# Altium schematic sheet MCU.SchDoc
size 420 x 297 mm; Address1: Address1; Address2: Address2; Address3: Address3; Address4: Address4; SheetNumber: 2; SheetTotal: 2; Scale: 1:1; Обозначение документа: ВРГД.468332.001 Э3
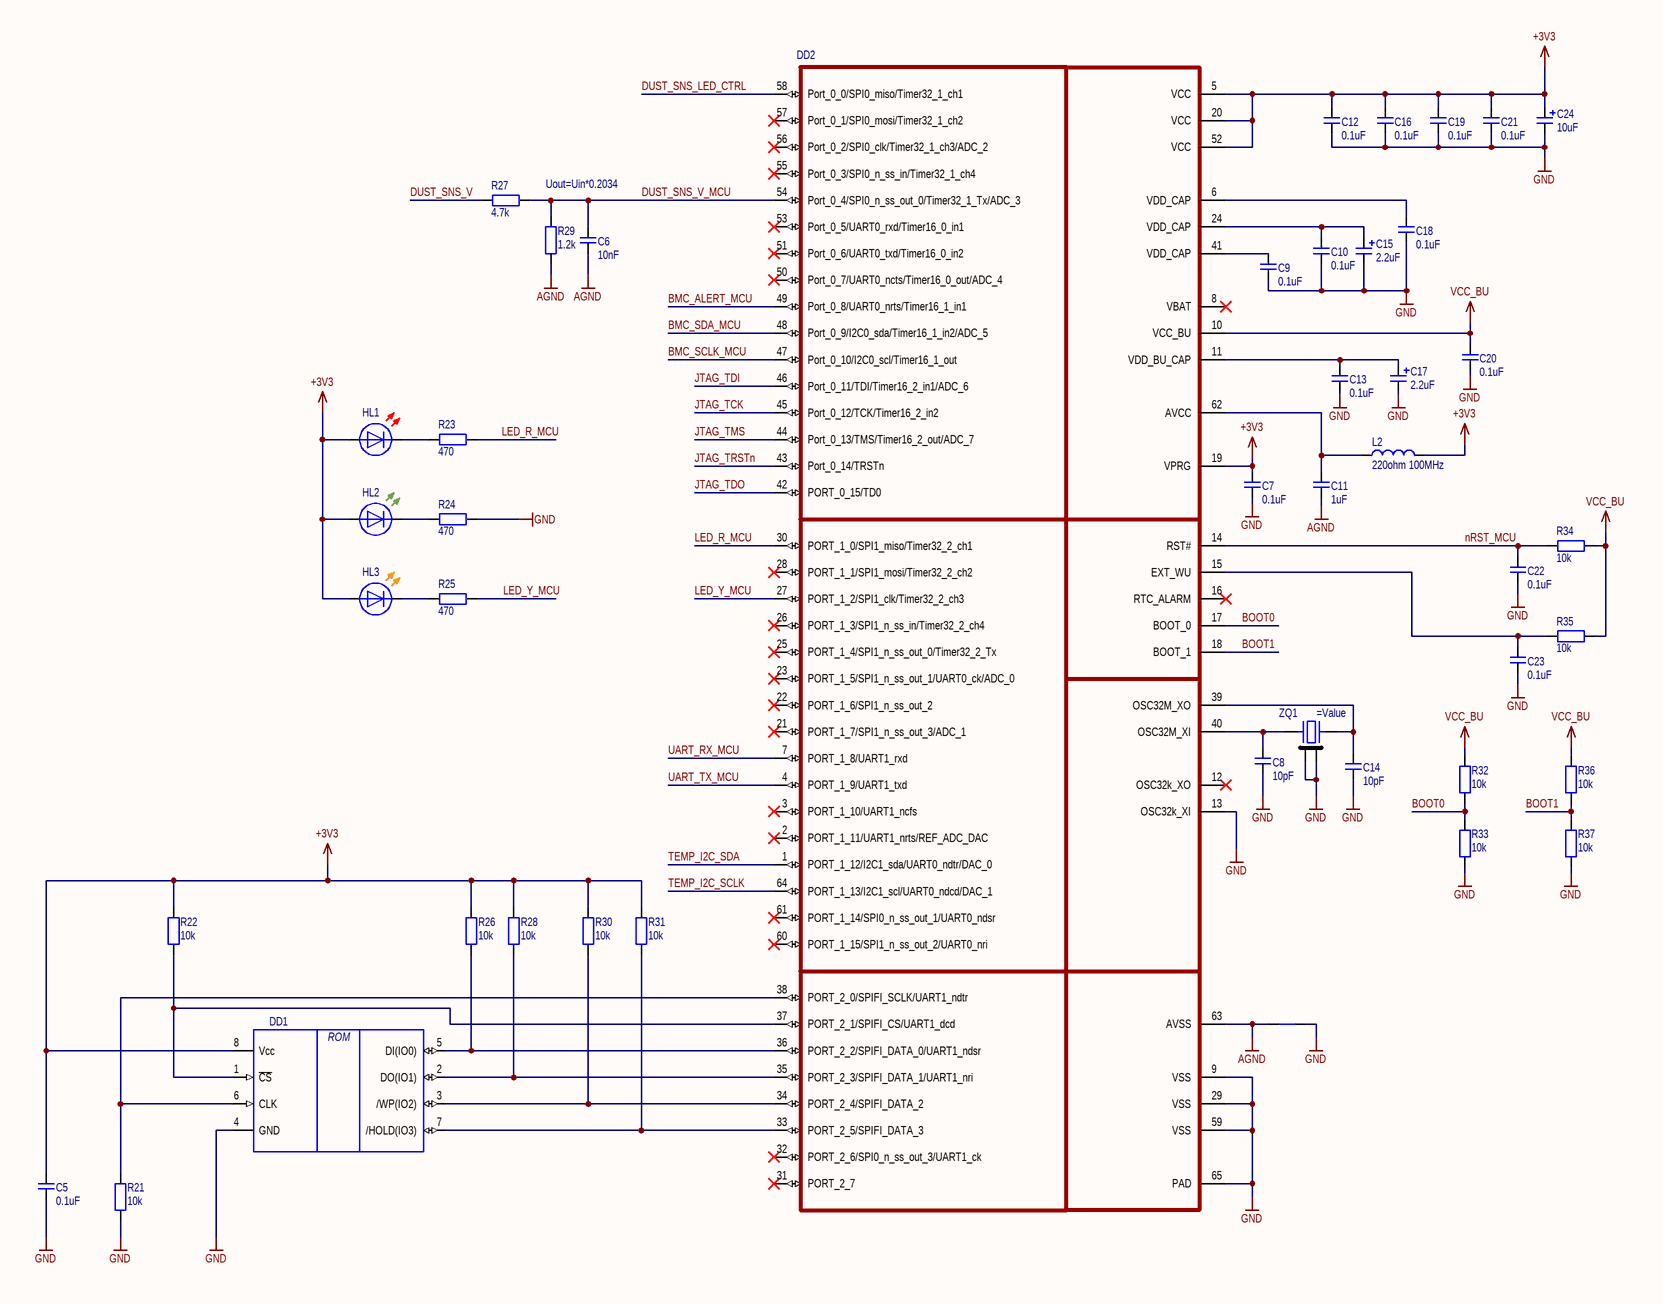
[diagram p0: MCU.SchDoc]

## Parts
C5  0.1uF  [CAP 0603_1608]
C6  10nF  [CAP 0603_1608]
C7  0.1uF  [CAP 0603_1608]
C8  10pF  [CAP 0603_1608]
C9  0.1uF  [CAP 0603_1608]
C10  0.1uF  [CAP 0603_1608]
C11  1uF  [CAP 0805_2012]
C12  0.1uF  [CAP 0603_1608]
C13  0.1uF  [CAP 0603_1608]
C14  10pF  [CAP 0603_1608]
C15  2.2uF  [CAP ALSMD ELEC 4.3MM H5.4MM]
C16  0.1uF  [CAP 0603_1608]
C17  2.2uF  [CAP ALSMD ELEC 4.3MM H5.4MM]
C18  0.1uF  [CAP 0603_1608]
C19  0.1uF  [CAP 0603_1608]
C20  0.1uF  [CAP 0603_1608]
C21  0.1uF  [CAP 0603_1608]
C22  0.1uF  [CAP 0603_1608]
C23  0.1uF  [CAP 0603_1608]
C24  10uF  [CAP ALSMD ELEC 4.3MM H5.4MM]
DD1  W25Q16JVSNIQ  [WINBOND SOIC-8]  (value not drawn)
DD2  К1948ВК018 АДКБ.431290.418ТУ  [QFN40P800X800X76_HS-65M]  (value not drawn)
HL1  KP-1608SURC  [LED 0603_1608 RED]  (value not drawn)
HL2  KPH-1608MGC  [LED 0603_1608 GREEN]  (value not drawn)
HL3  KPH-1608SYC  [LED 0603_1608 YELLOW]  (value not drawn)
J1  (no value)  [NET_TIE_1MM]  (net tie, no BOM)
L2  220ohm 100MHz  [FER 0805_2012]
R21  10k  [RES 0603_1608]
R22  10k  [RES 0603_1608]
R23  470  [RES 0603_1608]
R24  470  [RES 0603_1608]
R25  470  [RES 0603_1608]
R26  10k  [RES 0603_1608]
R27  4.7k  [RES 0603_1608]
R28  10k  [RES 0603_1608]
R29  1.2k  [RES 0603_1608]
R30  10k  [RES 0603_1608]
R31  10k  [RES 0603_1608]
R32  10k  [RES 0603_1608]
R33  10k  [RES 0603_1608]
R34  10k  [RES 0603_1608]
R35  10k  [RES 0603_1608]
R36  10k  [RES 0603_1608]
R37  10k  [RES 0603_1608]
ZQ1  (no value)  [XTAL3225X07N]

## Nets
+3V3: C5.2 C7.2 C12.2 C16.2 C19.2 C21.2 C24.1(P) DD1.8(Vcc) DD2.5(VCC) DD2.19(VPRG) DD2.20(VCC) DD2.52(VCC) HL1.1(A) HL2.1(A) HL3.1(A) L2.2(N) R22.1 R26.2 R28.2 R30.2 R31.2
AGND: C6.1 C11.1 DD2.63(AVSS) J1.1(P) R29.1
GND: C5.1 C7.1 C8.1 C9.1 C10.1 C12.1 C13.1 C14.1 C15.2(N) C16.1 C17.2(N) C18.1 C19.1 C20.1 C21.1 C22.1 C23.1 C24.2(N) DD1.4(GND) DD2.9(VSS) DD2.13(OSC32k_XI) DD2.29(VSS) DD2.59(VSS) DD2.65(PAD) J1.2(N) R21.1 R24.2 R33.1 R37.1 ZQ1.2 ZQ1.4
VCC_BU: C20.2 DD2.10(VCC_BU) R32.2 R34.1 R35.1 R36.2
BMC_ALERT_MCU: DD2.49(Port_0_8/UART0_nrts/Timer16_1_in1)
BMC_SCLK_MCU: DD2.47(Port_0_10/I2C0_scl/Timer16_1_out)
BMC_SDA_MCU: DD2.48(Port_0_9/I2C0_sda/Timer16_1_in2/ADC_5)
BOOT0: DD2.17(BOOT_0) R32.1 R33.2
BOOT1: DD2.18(BOOT_1) R36.1 R37.2
DUST_SNS_LED_CTRL: DD2.58(Port_0_0/SPI0_miso/Timer32_1_ch1)
DUST_SNS_V: R27.1
DUST_SNS_V_MCU: C6.2 DD2.54(Port_0_4/SPI0_n_ss_out_0/Timer32_1_Tx/ADC_3) R27.2 R29.2
JTAG_TCK: DD2.45(Port_0_12/TCK/Timer16_2_in2)
JTAG_TDI: DD2.46(Port_0_11/TDI/Timer16_2_in1/ADC_6)
JTAG_TDO: DD2.42(PORT_0_15/TD0)
JTAG_TMS: DD2.44(Port_0_13/TMS/Timer16_2_out/ADC_7)
JTAG_TRSTn: DD2.43(Port_0_14/TRSTn)
LED_R_MCU: DD2.30(PORT_1_0/SPI1_miso/Timer32_2_ch1) R23.2
LED_Y_MCU: DD2.27(PORT_1_2/SPI1_clk/Timer32_2_ch3) R25.2
nRST_MCU: C22.2 DD2.14(RST#) R34.2
TEMP_I2C_SCLK: DD2.64(PORT_1_13/I2C1_scl/UART0_ndcd/DAC_1)
TEMP_I2C_SDA: DD2.1(PORT_1_12/I2C1_sda/UART0_ndtr/DAC_0)
UART_RX_MCU: DD2.7(PORT_1_8/UART1_rxd)
UART_TX_MCU: DD2.4(PORT_1_9/UART1_txd)
NetC8_2: C8.2 DD2.40(OSC32M_XI) ZQ1.1
NetC9_2: C9.2 DD2.41(VDD_CAP)
NetC10_2: C10.2 C15.1(P) DD2.24(VDD_CAP)
NetC11_2: C11.2 DD2.62(AVCC) L2.1(P)
NetC13_2: C13.2 C17.1(P) DD2.11(VDD_BU_CAP)
NetC14_2: C14.2 DD2.39(OSC32M_XO) ZQ1.3
NetC18_2: C18.2 DD2.6(VDD_CAP)
NetC23_2: C23.2 DD2.15(EXT_WU) R35.2
NetDD1_1: DD1.1(~{CS}) DD2.37(PORT_2_1/SPIFI_CS/UART1_dcd) R22.2
NetDD1_2: DD1.2(DO(IO1)) DD2.35(PORT_2_3/SPIFI_DATA_1/UART1_nri) R28.1
NetDD1_3: DD1.3(/WP(IO2)) DD2.34(PORT_2_4/SPIFI_DATA_2) R30.1
NetDD1_5: DD1.5(DI(IO0)) DD2.36(PORT_2_2/SPIFI_DATA_0/UART1_ndsr) R26.1
NetDD1_6: DD1.6(CLK) DD2.38(PORT_2_0/SPIFI_SCLK/UART1_ndtr) R21.2
NetDD1_7: DD1.7(/HOLD(IO3)) DD2.33(PORT_2_5/SPIFI_DATA_3) R31.1
NetHL1_2: HL1.2(C) R23.1
NetHL2_2: HL2.2(C) R24.1
NetHL3_2: HL3.2(C) R25.1

Not connected (* = marked no-connect by the designer): DD2 2(PORT_1_11/UART1_nrts/REF_ADC_DAC)* 3(PORT_1_10/UART1_ncfs)* 8(VBAT)* 12(OSC32k_XO)* 16(RTC_ALARM)* 21(PORT_1_7/SPI1_n_ss_out_3/ADC_1)* 22(PORT_1_6/SPI1_n_ss_out_2)* 23(PORT_1_5/SPI1_n_ss_out_1/UART0_ck/ADC_0)* 25(PORT_1_4/SPI1_n_ss_out_0/Timer32_2_Tx)* 26(PORT_1_3/SPI1_n_ss_in/Timer32_2_ch4)* 28(PORT_1_1/SPI1_mosi/Timer32_2_ch2)* 31(PORT_2_7)* 32(PORT_2_6/SPI0_n_ss_out_3/UART1_ck)* 50(Port_0_7/UART0_ncts/Timer16_0_out/ADC_4)* 51(Port_0_6/UART0_txd/Timer16_0_in2)* 53(Port_0_5/UART0_rxd/Timer16_0_in1)* 55(Port_0_3/SPI0_n_ss_in/Timer32_1_ch4)* 56(Port_0_2/SPI0_clk/Timer32_1_ch3/ADC_2)* 57(Port_0_1/SPI0_mosi/Timer32_1_ch2)* 60(PORT_1_15/SPI1_n_ss_out_2/UART0_nri)* 61(PORT_1_14/SPI0_n_ss_out_1/UART0_ndsr)*

## Notes on the sheet
- Uout=Uin*0.2034
- Подп. и дата
- Инв. № дубл.
- Взам. инв. №
- Инв. № подл.
- Изм.
- Лист
- № докум.
- Подп.
- Дата
- Копировал
- Формат А3
- (in symbol W25Q16JVSNIQ) ROM

## Library data of the parts
C5 C7 C9 C10 C12 C13 C16 C18-C23 = GRM188R71E104K: Конденсатор 0603-X7R-25В-0,1мкФ ± 10%; Manufacturer: Murata Electronics; Group: Конденсаторы; Type: Конденсатор керамический; Dielectric type: X7R; Voltage: 25V; Manufacturer Part Number: GRM188R71E104K; Name: GRM188R71E104K; Value: 0.1uF; Tolerance: ± 10%; Country: Япония; Package: SMD0603
C6 = GRM188R71E103K: Конденсатор 0603-X7R-25В-10мкФ ± 10%; Manufacturer: Murata Electronics; Group: Конденсаторы; Type: Конденсатор керамический; Dielectric type: X7R; Voltage: 25V; Manufacturer Part Number: GRM188R71E103K; Name: GRM188R71E103K; Value: 10nF; Tolerance: ± 10%; Country: Япония; Package: SMD0603
C8 C14 = CC0603KRNPO9BN100: Конденсатор 0603-C0G-50В-10пФ ± 10%; Manufacturer: Yageo; Group: Конденсаторы; Type: Конденсатор керамический; Dielectric type: C0G; Voltage: 50V; Manufacturer Part Number: CC0603KRNPO9BN100; Name: CC0603KRNPO9BN100; Value: 10pF; Tolerance: ± 10%; Country: Тайвань; Package: SMD0603
C11 = GRM21BR71E105KA99L: Конденсатор 0805-X7R-25В-1мкФ ± 10%; Manufacturer: Murata Electronics; Group: Конденсаторы; Type: Конденсатор керамический; Dielectric type: X7R; Voltage: 25V; Manufacturer Part Number: GRM21BR71E105KA99L; Name: GRM21BR71E105KA99L; Value: 1uF; Tolerance: ± 10%; Country: Япония; Package: SMD0805
C15 C17 = К50-97 – 50В – 2,2мкФ (±20) % – ЕВАЯ.673541.054ТУ: Конденсатор К50-97 – 50В – 2,2мкФ (±20) % – ЕВАЯ.673541.054ТУ; Manufacturer: АО Элеконд; Group: Конденсаторы полярные; Type: Конденсатор электролитический; Tolerance: ± 20%; Dielectric type: Electrolytic; Voltage: 50V; Manufacturer Part Number: К50-97 – 50В – 2,2мкФ (±20) % – ЕВАЯ.673541.054ТУ; Name: К50-97 – 50В – 2,2мкФ (±20) % – ЕВАЯ.673541.054ТУ; Value: 2.2uF; Country: Россия; Package: SMD D4x5.4; HelpURL: https://elecond.ru/pdf/k50-97.pdf
C24 = К50-97 – 25В – 10мкФ (±20) % – ЕВАЯ.673541.054ТУ: Конденсатор К50-97 – 25В – 10мкФ (±20) % – ЕВАЯ.673541.054ТУ; Manufacturer: АО Элеконд; Group: Конденсаторы полярные; Type: Конденсатор электролитический; Tolerance: ± 20%; Dielectric type: Electrolytic; Voltage: 25V; Manufacturer Part Number: К50-97 – 25В – 10мкФ (±20) % – ЕВАЯ.673541.054ТУ; Name: К50-97 – 25В – 10мкФ (±20) % – ЕВАЯ.673541.054ТУ; Value: 10uF; Country: Россия; Package: SMD D4x5.4; HelpURL: https://elecond.ru/pdf/k50-97.pdf
DD1 = W25Q16JVSNIQ: Память Flash W25Q16JVSNIQ; Manufacturer: Winbond; Group: Микросхемы; Supply Voltage: 3,3V; Max Temperature: 85°С; Min Temperature: -40°С; Notes: 16Mb(2M x 8); Manufacturer Part Number: W25Q16JVSNIQ; Type: Память Flash; Name: W25Q16JVSNIQ; Country: Тайвань; Package: SOIC-8; HelpURL: https://static.chipdip.ru/lib/136/DOC012136857.pdf
DD2 = К1948ВК018 АДКБ.431290.418ТУ: Микроконтроллер К1948ВК018 АДКБ.431290.418ТУ; Manufacturer: АО «МИКРОН»; Group: Микросхемы; Supply Voltage: 3,3V; Max Temperature: 85°С; Min Temperature: -45°С; Manufacturer Part Number: К1948ВК018 АДКБ.431290.418ТУ; Type: Микроконтроллер; Package: QFN40; HelpURL: https://mikron.ru/upload/docs/mcu/Information_AMUR_MIK32.pdf; Name: К1948ВК018 АДКБ.431290.418ТУ; Country: Россия
HL1 = KP-1608SURC: Светодиод KP-1608SURC; Manufacturer: Kingbright; Group: Светодиоды; Max Vr: 5V; Max If: 20mA; Manufacturer Part Number: KP-1608SURC; Type: Светодиод; Name: KP-1608SURC; Country: Тайвань; Package: SMD1608
HL2 = KPH-1608MGC: Светодиод KPH-1608MGC; Manufacturer: Kingbright; Group: Светодиоды; Max Vr: 5V; Max If: 20mA; Manufacturer Part Number: KPH-1608MGC; Type: Светодиод; Name: KPH-1608MGC; Country: Тайвань; Package: SMD1608
HL3 = KPH-1608SYC: Светодиод KPH-1608SYC; Manufacturer: Kingbright; Group: Светодиоды; Max Vr: 5V; Max If: 20mA; Manufacturer Part Number: KPH-1608SYC; Type: Светодиод; Name: KPH-1608SYC; Country: Тайвань; Package: SMD1608
J1 = NET_TIE_1MM: Перемычка SMD NET_TIE_1MM; Group: Перемычки; Manufacturer Part Number: NET_TIE_1MM; Type: Перемычка SMD; Name: NET_TIE_1MM
L2 = UPZ2012U221-3R0TF: Индуктивность ЭМП 0805-3A-220Ом ± 25% 100MHz; Manufacturer: Sunlord; Group: Индуктивности; Type: Дроссель ЭМП; Current: 3A; Rdc: 40mОm; Manufacturer Part Number: UPZ2012U221-3R0TF; Name: UPZ2012U221-3R0TF; Value: 220ohm 100MHz; Tolerance: ±25%; Country: Китай; Package: SMD0805; HelpURL: https://static.chipdip.ru/lib/840/DOC012840723.pdf
R21 R22 R26 R28 R30-R37 = Р1-12 - 0,1 - 10кОм ±1%: Резистор Р1-12 - 0,1 - 10кОм ±1%; Manufacturer: АО «Ресурс»; Group: Резисторы; Power: 0.1W; Voltage: 50V; Manufacturer Part Number: Р1-12 - 0,1 - 10кОм ±1%; Type: Резистор; Name: Р1-12 - 0,1 - 10кОм ±1%; Value: 10k; Tolerance: ± 1%; Country: Россия; Package: SMD0603; HelpURL: https://aoresurs.com/upload/iblock/4b6/hnw668dxbiwjyxv0ejq9urcu5m58703r/Datasheet-R1_12-SHKAB.434110.024TU.pdf
R23-R25 = Р1-12 - 0,1 - 470Ом ±1%: Резистор Р1-12 - 0,1 - 470Ом ±1%; Manufacturer: АО «Ресурс»; Group: Резисторы; Power: 0.1W; Voltage: 50V; Manufacturer Part Number: Р1-12 - 0,1 - 470Ом ±1%; Type: Резистор; Name: Р1-12 - 0,1 - 470Ом ±1%; Value: 470; Tolerance: ± 1%; Country: Россия; Package: SMD0603; HelpURL: https://aoresurs.com/upload/iblock/4b6/hnw668dxbiwjyxv0ejq9urcu5m58703r/Datasheet-R1_12-SHKAB.434110.024TU.pdf
R27 = Р1-12 - 0,1 - 4,7кОм ±1%: Резистор Р1-12 - 0,1 - 4,7кОм ±1%; Manufacturer: АО «Ресурс»; Group: Резисторы; Power: 0.1W; Voltage: 50V; Manufacturer Part Number: Р1-12 - 0,1 - 4,7кОм ±1%; Type: Резистор; Name: Р1-12 - 0,1 - 4,7кОм ±1%; Value: 4.7k; Tolerance: ± 1%; Country: Россия; Package: SMD0603; HelpURL: https://aoresurs.com/upload/iblock/4b6/hnw668dxbiwjyxv0ejq9urcu5m58703r/Datasheet-R1_12-SHKAB.434110.024TU.pdf
R29 = Р1-12 - 0,1 - 1,2кОм ±1%: Резистор Р1-12 - 0,1 - 1,2кОм ±1%; Manufacturer: АО «Ресурс»; Group: Резисторы; Power: 0.1W; Voltage: 50V; Manufacturer Part Number: Р1-12 - 0,1 - 1,2кОм ±1%; Type: Резистор; Name: Р1-12 - 0,1 - 1,2кОм ±1%; Value: 1.2k; Tolerance: ± 1%; Country: Россия; Package: SMD0603; HelpURL: https://aoresurs.com/upload/iblock/4b6/hnw668dxbiwjyxv0ejq9urcu5m58703r/Datasheet-R1_12-SHKAB.434110.024TU.pdf
ZQ1 = SJK-7U-32.000-10-10-40-C-10: Резонатор кварцевый SJK-7U-32.000-10-10-40-C-10; Manufacturer: SJK; Value: 32MHz; Group: Кварцы; Tolerance: ±30ppm; Load Capacity: 10pF; ESR: 60Ohm; Manufacturer Part Number: SJK-7U-32.000-10-10-40-C-10; Type: Кварцевый резонатор; Name: SJK-7U-32.000-10-10-40-C-10; Freq: 32MHz; Country: Китай; Package: SMD32x25x07; HelpURL: https://static.chipdip.ru/lib/087/DOC053087027.pdf